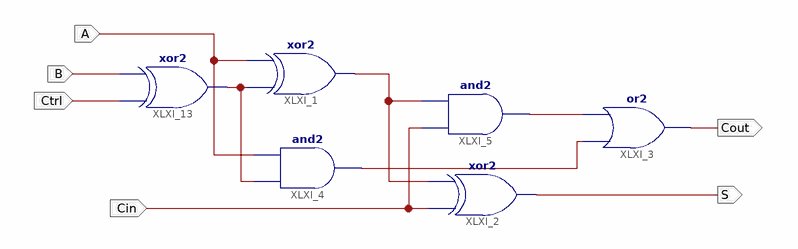
[diagram p0: schematic sheet 1]
// Xilinx ISE schematic NewAddsub1b.sch (kintex7) as structural Verilog: 6 symbols, 6 ports
module NewAddsub1b (
  input  Cin,
  input  A,
  input  Ctrl,
  input  B,
  output S,
  output Cout
);

  wire XLXN_1, XLXN_3, XLXN_4, XLXN_33;

  xor XLXI_1 (XLXN_1, XLXN_33, A);
  xor XLXI_2 (S, Cin, XLXN_1);
  or XLXI_3 (Cout, XLXN_3, XLXN_4);
  and XLXI_4 (XLXN_3, XLXN_33, A);
  and XLXI_5 (XLXN_4, Cin, XLXN_1);
  xor XLXI_13 (XLXN_33, Ctrl, B);
endmodule
